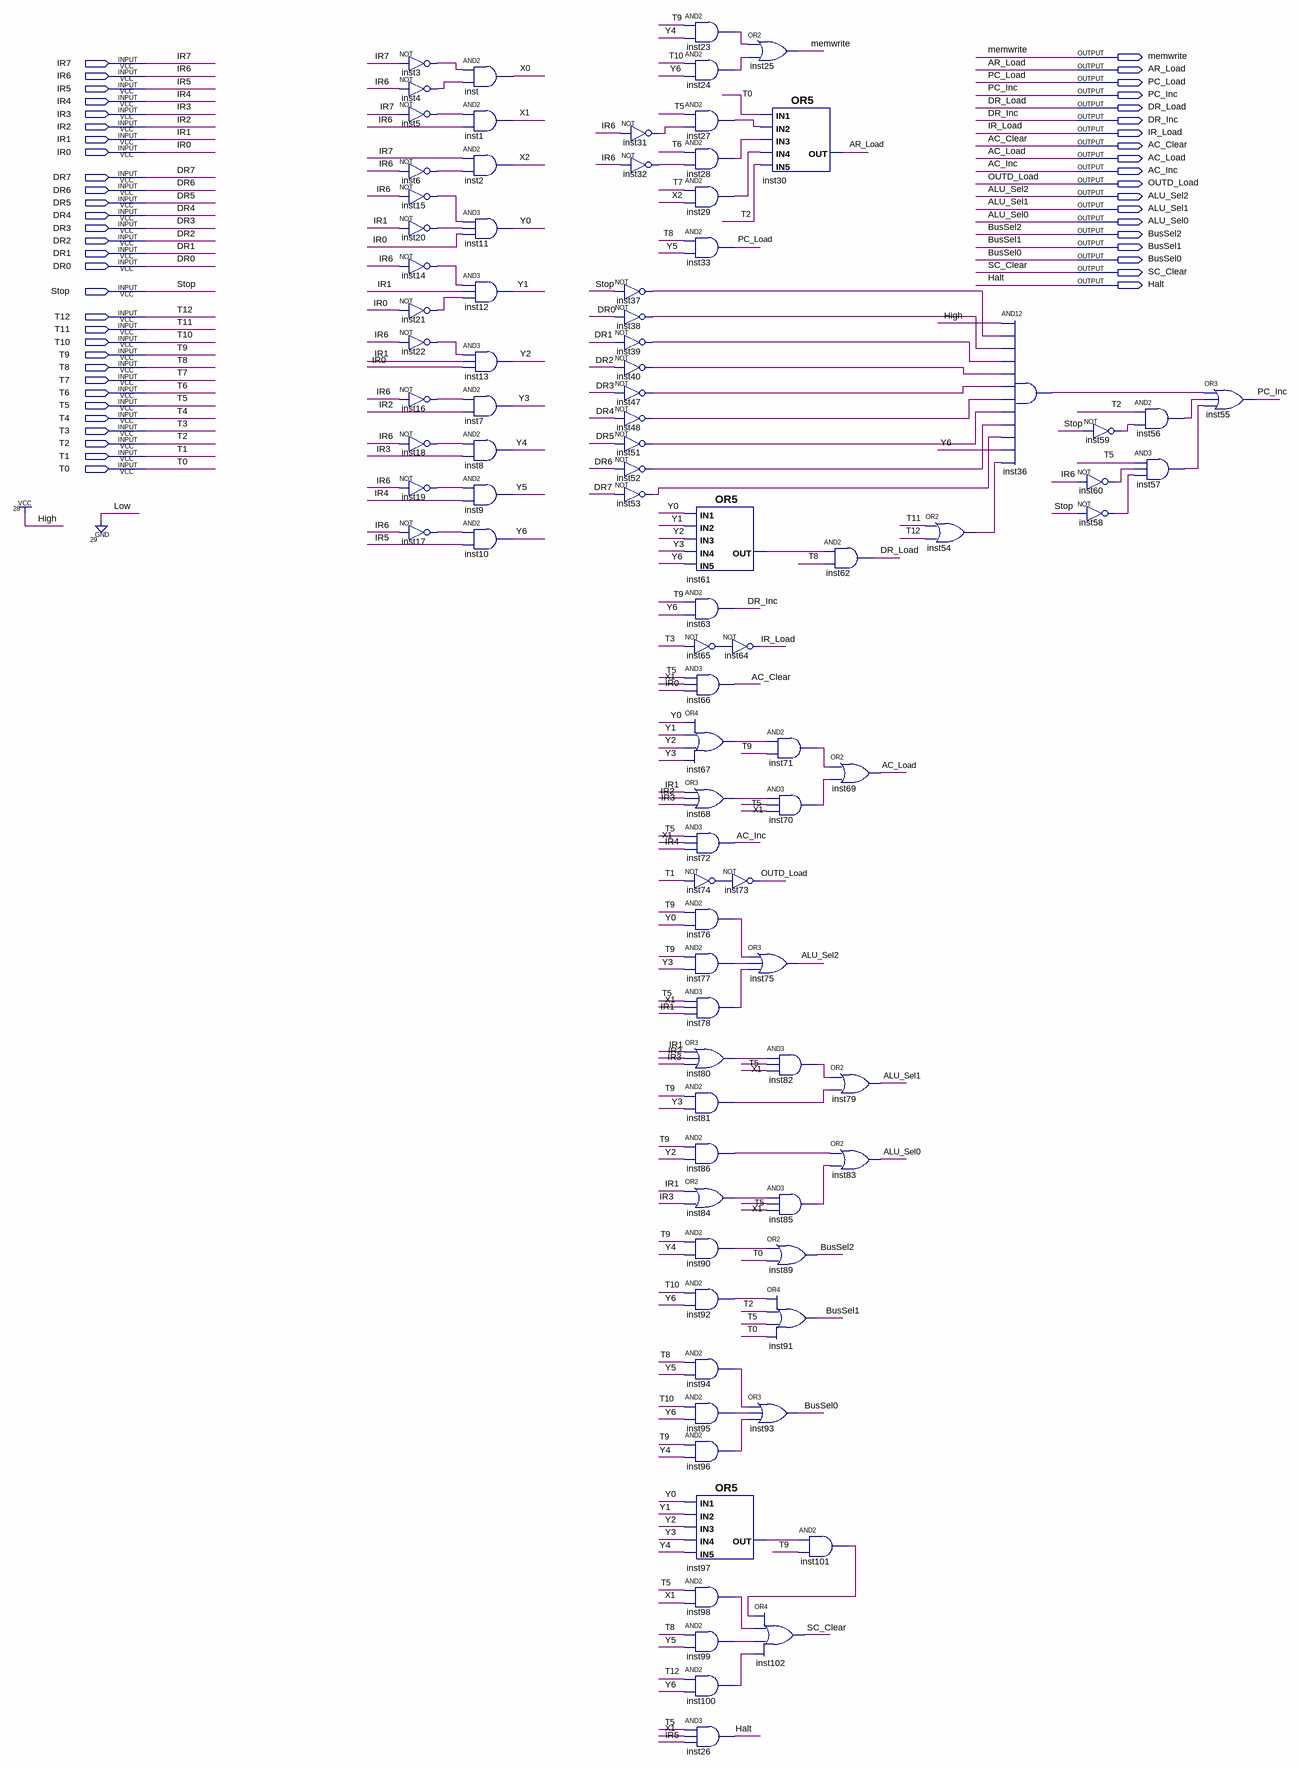
[diagram p0: schematic sheet]
// Quartus schematic lab3controller.bdf as structural Verilog: 91 symbols, 49 pins
module lab3controller (
  input  IR7,
  input  IR6,
  input  IR5,
  input  IR4,
  input  IR3,
  input  IR2,
  input  IR1,
  input  IR0,
  input  DR7,
  input  DR6,
  input  DR5,
  input  DR4,
  input  DR3,
  input  DR2,
  input  DR1,
  input  DR0,
  input  Stop,
  input  T12,
  input  T11,
  input  T10,
  input  T9,
  input  T8,
  input  T7,
  input  T6,
  input  T5,
  input  T4,
  input  T3,
  input  T2,
  input  T1,
  input  T0,
  output memwrite,
  output AR_Load,
  output PC_Load,
  output PC_Inc,
  output DR_Load,
  output DR_Inc,
  output IR_Load,
  output AC_Clear,
  output AC_Load,
  output AC_Inc,
  output OUTD_Load,
  output ALU_Sel2,
  output ALU_Sel1,
  output ALU_Sel0,
  output BusSel2,
  output BusSel1,
  output BusSel0,
  output SC_Clear,
  output Halt
);

  wire inst3_out, inst4_out, inst5_out, inst6_out, inst14_out, inst15_out, inst16_out, inst17_out,
       inst18_out, inst19_out, inst20_out, inst21_out, inst22_out, inst23_out, inst24_out, inst27_out,
       inst28_out, inst29_out, inst31_out, inst32_out, inst36_out, inst37_out, inst38_out, inst39_out,
       inst40_out, inst47_out, inst48_out, inst51_out, inst52_out, inst53_out, inst54_out, inst56_out,
       inst57_out, inst58_out, inst59_out, inst60_out, inst61_out, inst65_out, inst67_out, inst68_out,
       inst70_out, inst71_out, inst74_out, inst76_out, inst77_out, inst78_out, inst80_out, inst81_out,
       inst82_out, inst84_out, inst85_out, inst86_out, inst90_out, inst92_out, inst94_out, inst95_out,
       inst96_out, inst97_out, inst98_out, inst99_out, inst100_out, inst101_out, X0, X1, X2, Y0, Y1, Y2, Y3,
       Y4, Y5, Y6;

  not inst3 (inst3_out, IR7);
  not inst4 (inst4_out, IR6);
  not inst5 (inst5_out, IR7);
  not inst6 (inst6_out, IR6);
  not inst15 (inst15_out, IR6);
  not inst20 (inst20_out, IR1);
  not inst14 (inst14_out, IR6);
  not inst21 (inst21_out, IR0);
  not inst22 (inst22_out, IR6);
  not inst16 (inst16_out, IR6);
  not inst18 (inst18_out, IR6);
  not inst19 (inst19_out, IR6);
  not inst17 (inst17_out, IR6);
  and inst (X0, inst3_out, inst4_out);
  and inst1 (X1, inst5_out, IR6);
  and inst2 (X2, IR7, inst6_out);
  and inst11 (Y0, inst15_out, inst20_out, IR0);
  and inst12 (Y1, inst14_out, IR1, inst21_out);
  and inst13 (Y2, inst22_out, IR1, IR0);
  and inst7 (Y3, inst16_out, IR2);
  and inst8 (Y4, inst18_out, IR3);
  and inst9 (Y5, inst19_out, IR4);
  and inst10 (Y6, inst17_out, IR5);
  not inst31 (inst31_out, IR6);
  not inst32 (inst32_out, IR6);
  not inst37 (inst37_out, Stop);
  not inst38 (inst38_out, DR0);
  not inst39 (inst39_out, DR1);
  not inst40 (inst40_out, DR2);
  not inst47 (inst47_out, DR3);
  not inst48 (inst48_out, DR4);
  not inst51 (inst51_out, DR5);
  not inst52 (inst52_out, DR6);
  not inst53 (inst53_out, DR7);
  and inst23 (inst23_out, T9, Y4);
  and inst24 (inst24_out, T10, Y6);
  and inst27 (inst27_out, T5, inst31_out);
  and inst28 (inst28_out, T6, inst32_out);
  and inst29 (inst29_out, T7, X2);
  and inst33 (PC_Load, T8, Y5);
  or inst61 (inst61_out, Y0, Y1, Y2, Y3, Y6);
  and inst63 (DR_Inc, T9, Y6);
  not inst65 (inst65_out, T3);
  and inst66 (AC_Clear, T5, X1, IR0);
  or inst67 (inst67_out, Y0, Y1, Y2, Y3);
  or inst68 (inst68_out, IR1, IR2, IR3);
  and inst72 (AC_Inc, T5, X1, IR4);
  not inst74 (inst74_out, T1);
  and inst76 (inst76_out, T9, Y0);
  and inst77 (inst77_out, T9, Y3);
  and inst78 (inst78_out, T5, X1, IR1);
  or inst80 (inst80_out, IR1, IR2, IR3);
  and inst81 (inst81_out, T9, Y3);
  and inst86 (inst86_out, T9, Y2);
  or inst84 (inst84_out, IR1, IR3);
  and inst90 (inst90_out, T9, Y4);
  and inst92 (inst92_out, T10, Y6);
  and inst94 (inst94_out, T8, Y5);
  and inst95 (inst95_out, T10, Y6);
  and inst96 (inst96_out, T9, Y4);
  or inst97 (inst97_out, Y0, Y1, Y2, Y3, Y4);
  and inst98 (inst98_out, T5, X1);
  and inst99 (inst99_out, T8, Y5);
  and inst100 (inst100_out, T12, Y6);
  and inst26 (Halt, T5, X1, IR5);
  not inst64 (IR_Load, inst65_out);
  not inst73 (OUTD_Load, inst74_out);
  or inst25 (memwrite, inst23_out, inst24_out);
  or inst30 (AR_Load, T0, inst27_out, inst28_out, inst29_out, T2);
  and inst71 (inst71_out, inst67_out, T9);
  and inst70 (inst70_out, inst68_out, T5, X1);
  or inst75 (ALU_Sel2, inst76_out, inst77_out, inst78_out);
  and inst82 (inst82_out, inst80_out, T5, X1);
  and inst85 (inst85_out, inst84_out, T5, X1);
  or inst89 (BusSel2, inst90_out, T0);
  or inst91 (BusSel1, inst92_out, T2, T5, T0);
  or inst93 (BusSel0, inst94_out, inst95_out, inst96_out);
  or inst102 (SC_Clear, inst101_out, inst98_out, inst99_out, inst100_out);
  and inst62 (DR_Load, inst61_out, T8);
  or inst69 (AC_Load, inst71_out, inst70_out);
  or inst79 (ALU_Sel1, inst82_out, inst81_out);
  or inst83 (ALU_Sel0, inst86_out, inst85_out);
  and inst101 (inst101_out, inst97_out, T9);
  or inst54 (inst54_out, T11, T12);
  and inst36 (inst36_out, 1'b1, inst37_out, inst38_out, inst39_out, inst40_out, inst47_out, inst48_out, inst51_out, inst52_out, inst53_out, Y6, inst54_out);
  not inst59 (inst59_out, Stop);
  not inst60 (inst60_out, IR6);
  not inst58 (inst58_out, Stop);
  and inst56 (inst56_out, T2, inst59_out);
  and inst57 (inst57_out, T5, inst60_out, inst58_out);
  or inst55 (PC_Inc, inst36_out, inst56_out, inst57_out);
endmodule
